# Altium project CRD25DA12N-FMC V1-1 (07-2023).PrjPcb (part 4 of 8)
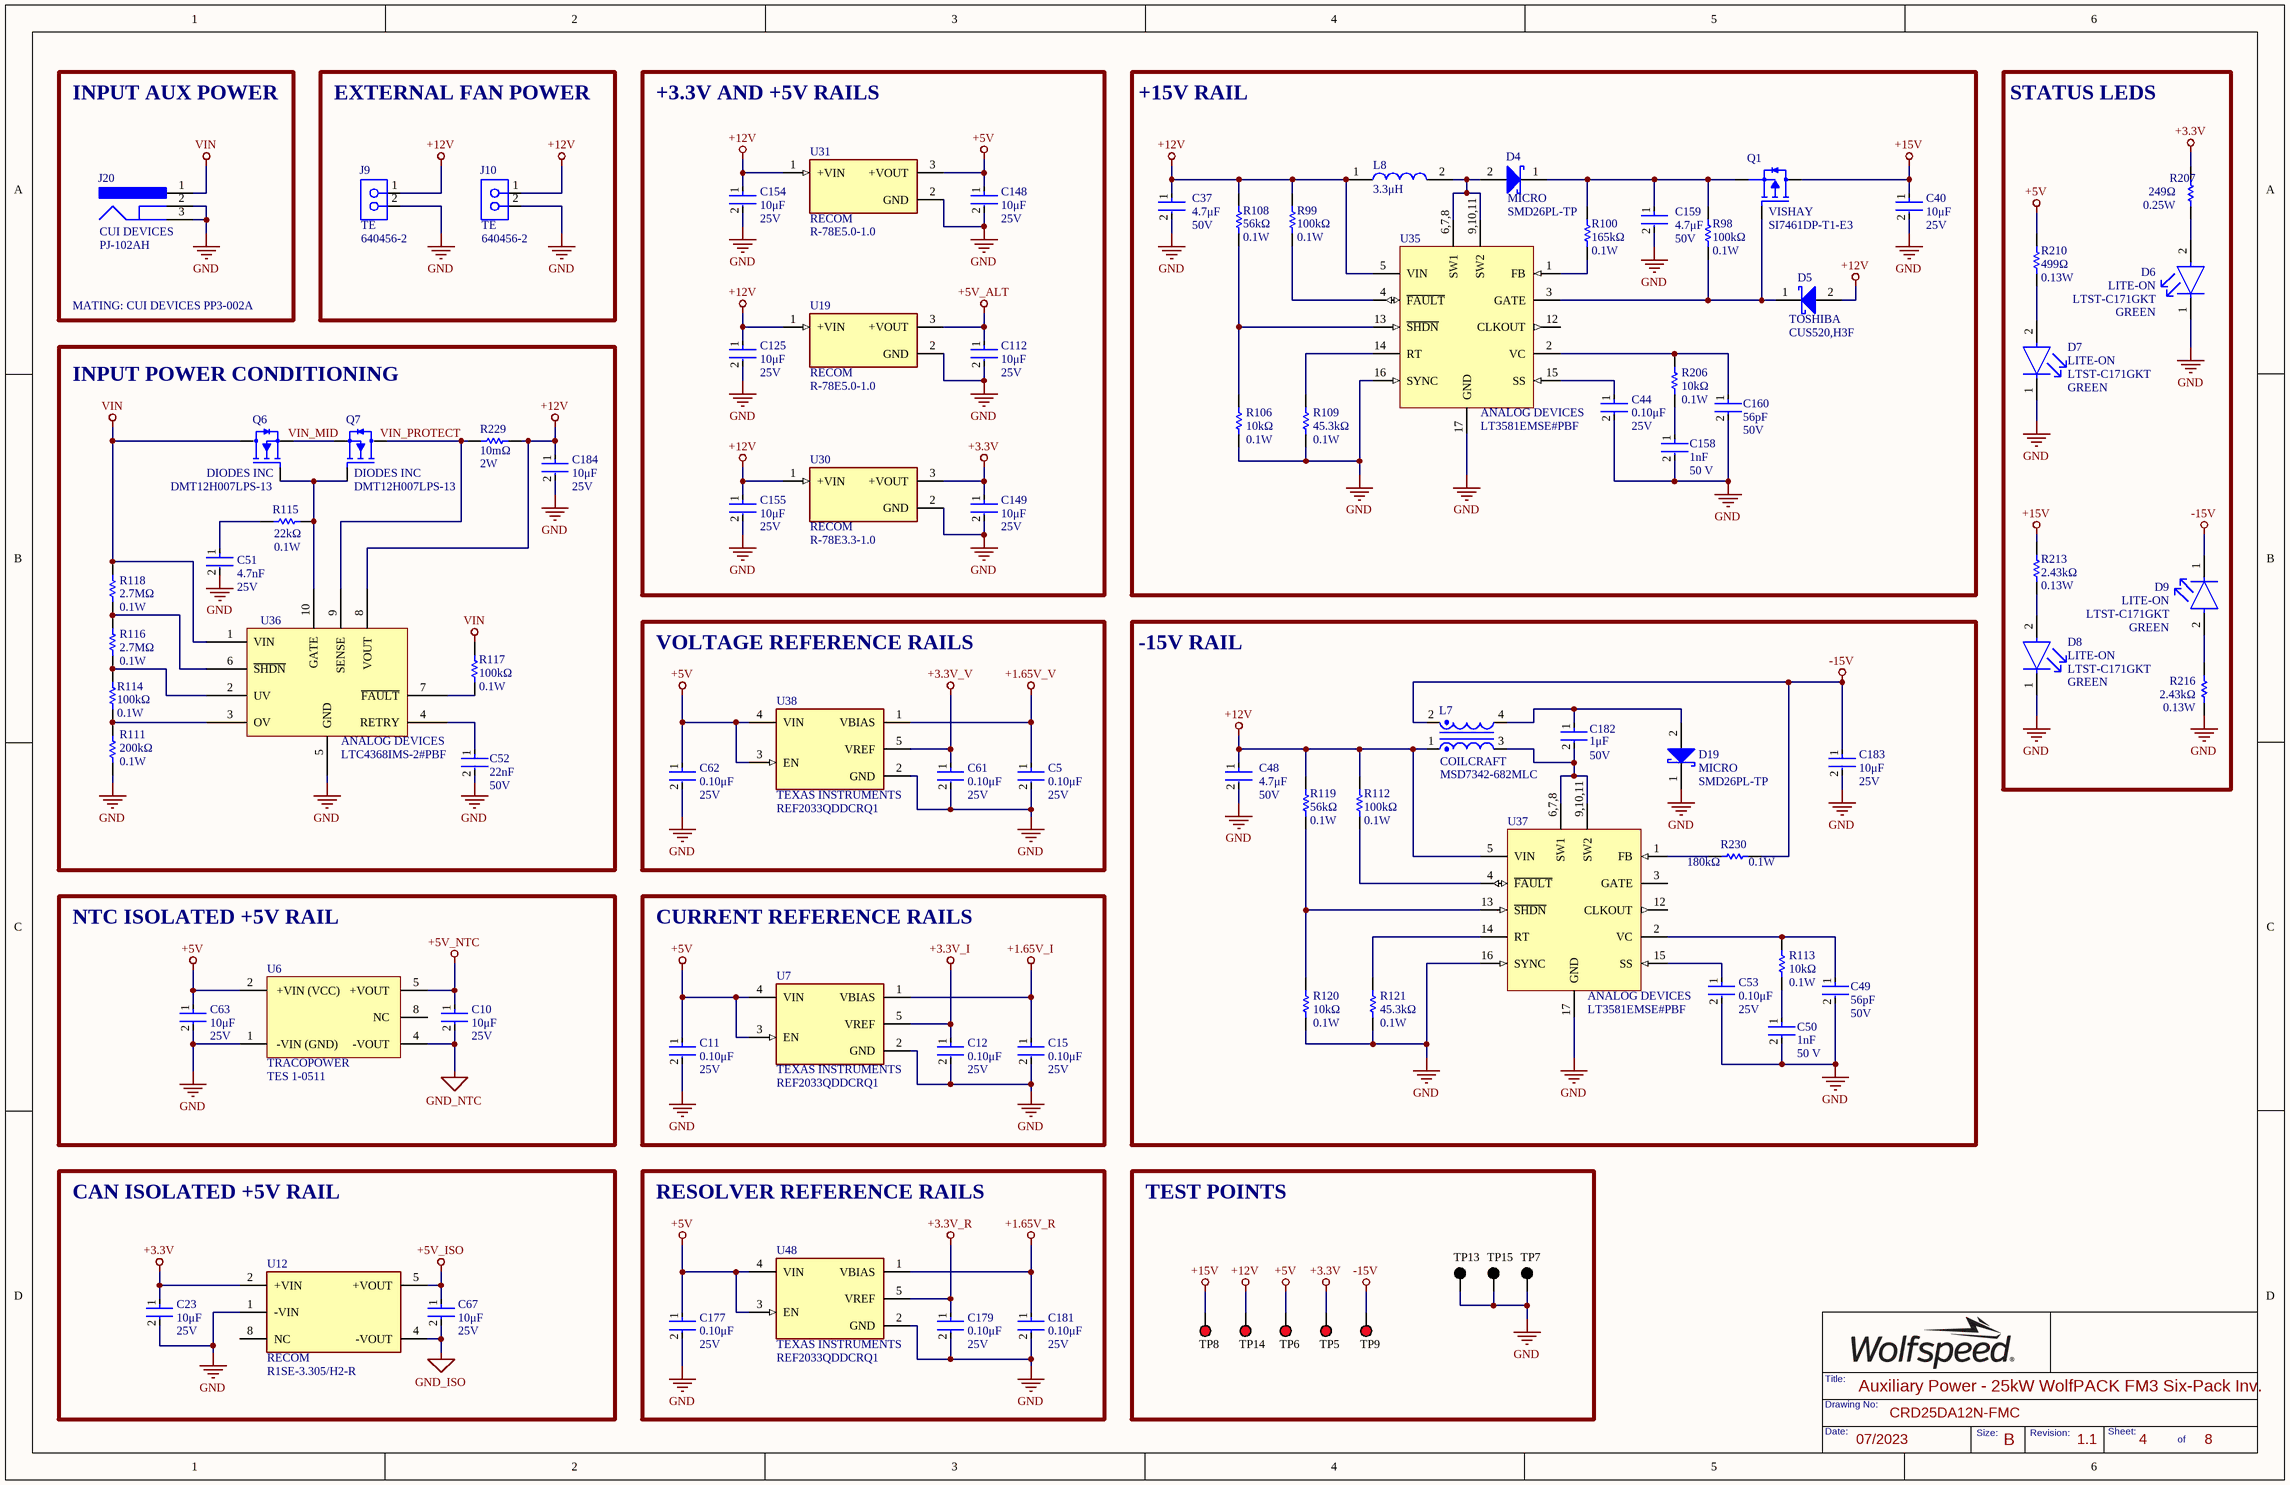
[diagram p9: 04 - Auxiliary Power.SchDoc]

## Sheet 04 - Auxiliary Power.SchDoc: Auxiliary Power - 25kW WolfPACK FM3 Six-Pack Inv. (continued)

### Library data of the parts (continued)
U19 U31 = R-78E5.0-1.0: DC DC CONVERTER 5V 5W; Number of Outputs: 1; Min Input Voltage: 8V; Max Input Voltage: 28V; Max Output Current: 1A; Efficiency: 91%; Supplier 1: Rs; Manufacturer: RECOM; Manufacturer Part Number: R-78E5.0-1.0; RoHS: Yes; Category: Voltage Regulators - Switching; Stock 1: 661; Mount: Through Hole; Case/Package: SIP; Weight: 2g; Min Operating Temperature: -40°C; Max Operating Temperature: 85°C; Packaging: Rail/Tube; Voltage - Output 1: 5V; Max Power Dissipation: 5W; Output Power: 5W; Current - Output 1: 1A; Package Quantity: 42; Max Output Voltage: 5V; Features: SCP; Length: 11.6mm; Width: 8.5mm; Height: 10.4mm; Lead Free: Lead Free; RoHS Compliant: Yes; ComponentLink1URL: http://www.farnell.com/datasheets/2787646.pdf?src-supplier=Farnell; ComponentLink1Description: http://www.farnell.com/datasheets/2787646.pdf?src-supplier=Farnell; ComponentLink2URL: http://www.mouser.com/ds/2/468/R-78Exx-1.0-958279.pdf?src-supplier=Mouser; ComponentLink2Description: http://www.mouser.com/ds/2/468/R-78Exx-1.0-958279.pdf?src-supplier=Mouser; ComponentLink3URL: https://www.recom-power.com/pdf/Innoline/R-78Exx-1.0.pdf?src-supplier=Digi-Key; ComponentLink3Description: https://www.recom-power.com/pdf/Innoline/R-78Exx-1.0.pdf?src-supplier=Digi-Key; ComponentLink4URL: http://www.farnell.com/datasheets/1848475.pdf?src-supplier=Newark; ComponentLink4Description: http://www.farnell.com/datasheets/1848475.pdf?src-supplier=Newark; ComponentLink5URL: http://www.farnell.com/datasheets/2787646.pdf?src-supplier=Element14; ComponentLink5Description: http://www.farnell.com/datasheets/2787646.pdf?src-supplier=Element14; ComponentLink6URL: http://datasheet.octopart.com/R-78E5.0-1.0-Recom-Power-datasheet-68298118.pdf?src-supplier=Rs; ComponentLink6Description: http://datasheet.octopart.com/R-78E5.0-1.0-Recom-Power-datasheet-68298118.pdf?src-supplier=Rs; Supplier Part Number 1: 1446013; Package: 3-SIP; Value: N/A
U30 = R-78E3.3-1.0: DC DC CONVERTER 3.3V 3W; Number of Outputs: 1; Min Input Voltage: 8V; Max Input Voltage: 28V; Max Output Current: 1A; Efficiency: 91%; Max Output Power: 3.3W; Min Input Voltage (DC): 7V; Supplier 1: Rs; Manufacturer: RECOM; Manufacturer Part Number: R-78E3.3-1.0; RoHS: Yes; Category: Board Mount Modules; Stock 1: 1; Pricing 1: 1=3.93700, 5=3.82200, 10=3.69700, 25=3.58300, 50=3.46900 (USD); Mount: Through Hole; Case/Package: SIP; Weight: 2g; Min Operating Temperature: -40°C; Max Operating Temperature: 85°C; Packaging: Rail/Tube; Voltage - Output 1: 3.3V; Nominal Output Voltage: 3.3V; Max Input Voltage (DC): 28V; Max Power Dissipation: 3W; Max Output Voltage: 3.3V; Features: SCP; Series: INNOLINE R-78E; Length: 11.6mm; Width: 8.5mm; Height: 10.4mm; Reach SVHC Compliant: Yes; Lead Free: Lead Free; RoHS Compliant: Yes; ComponentLink1URL: http://www.farnell.com/datasheets/2787646.pdf?src-supplier=Farnell; ComponentLink1Description: http://www.farnell.com/datasheets/2787646.pdf?src-supplier=Farnell; ComponentLink2URL: https://www.recom-power.com/pdf/Innoline/R-78Exx-1.0.pdf?src-supplier=Digi-Key; ComponentLink2Description: https://www.recom-power.com/pdf/Innoline/R-78Exx-1.0.pdf?src-supplier=Digi-Key; ComponentLink3URL: http://www.farnell.com/datasheets/1965125.pdf?src-supplier=Element14; ComponentLink3Description: http://www.farnell.com/datasheets/1965125.pdf?src-supplier=Element14; ComponentLink4URL: http://www.farnell.com/datasheets/2787646.pdf?src-supplier=Newark; ComponentLink4Description: http://www.farnell.com/datasheets/2787646.pdf?src-supplier=Newark; Supplier Part Number 1: 9176626; Package: 3-SIP; Value: N/A
U35 U37 = LT3581EMSE#PBF: IC REG MULTI CONFG ADJ 16MSOP; Number of Outputs: 1; Frequency Adjust Range: Up - 2.5MHz; RoHS: TRUE; PackageDescription: 16-Pin Plastic MSOP, Exposed Die Pad, Body 4.039 x 3 mm, Pitch 0.5 mm; Mounting Technology: Surface Mount; ComponentLink3URL: http://cds.linear.com/docs/en/packaging/05081667_F_MSE16.pdf; PackageReference: MSE-16; ComponentLink2Description: Datasheet; Manufacturer: ANALOG DEVICES; ComponentLink3Description: Package Specification; ComponentLink1Description: Manufacturer URL; ComponentLink1URL: http://www.linear.com/; ComponentLink2URL: http://cds.linear.com/docs/en/datasheet/3581f.pdf; PackageVersion: Rev. F, 05/2013; Supplier 1: Newark; Supplier Part Number 1: 51AK8743; Manufacturer Part Number: LT3581EMSE#PBF; Package: 16-TFSOP; Value: N/A
U36 = LTC4368IMS-2#PBF: IC SURGE SUPPRESSION ADJ 10MSOP; Supplier 1: Digi-Key; Manufacturer: ANALOG DEVICES; Manufacturer Part Number: LTC4368IMS-2#PBF; RoHS: Yes; Category: Power Management ICs; Pricing 1: 1=6.69000, 10=6.03900, 25=5.75840, 100=5.00000, 250=4.77528, 500=4.35396, 1000=3.97500 (USD); ComponentLink1URL: http://www.linear.com/docs/57622?src-supplier=Digi-Key; ComponentLink1Description: http://www.linear.com/docs/57622?src-supplier=Digi-Key; Supplier Part Number 1: 505-LTC4368IMS-2#PBF-ND; Package: 10-MSOP; Value: N/A

## Sheet 05 - Gate Drivers.SchDoc: Gate Drivers - 25kW WolfPACK FM3 Six-Pack Inv.
size 431 x 279 mm; Date: 07/2023; DocumentNumber: CRD25DA12N-FMC; Revision: 1.1; SheetNumber: 5; SheetTotal: 8; SheetSize: B
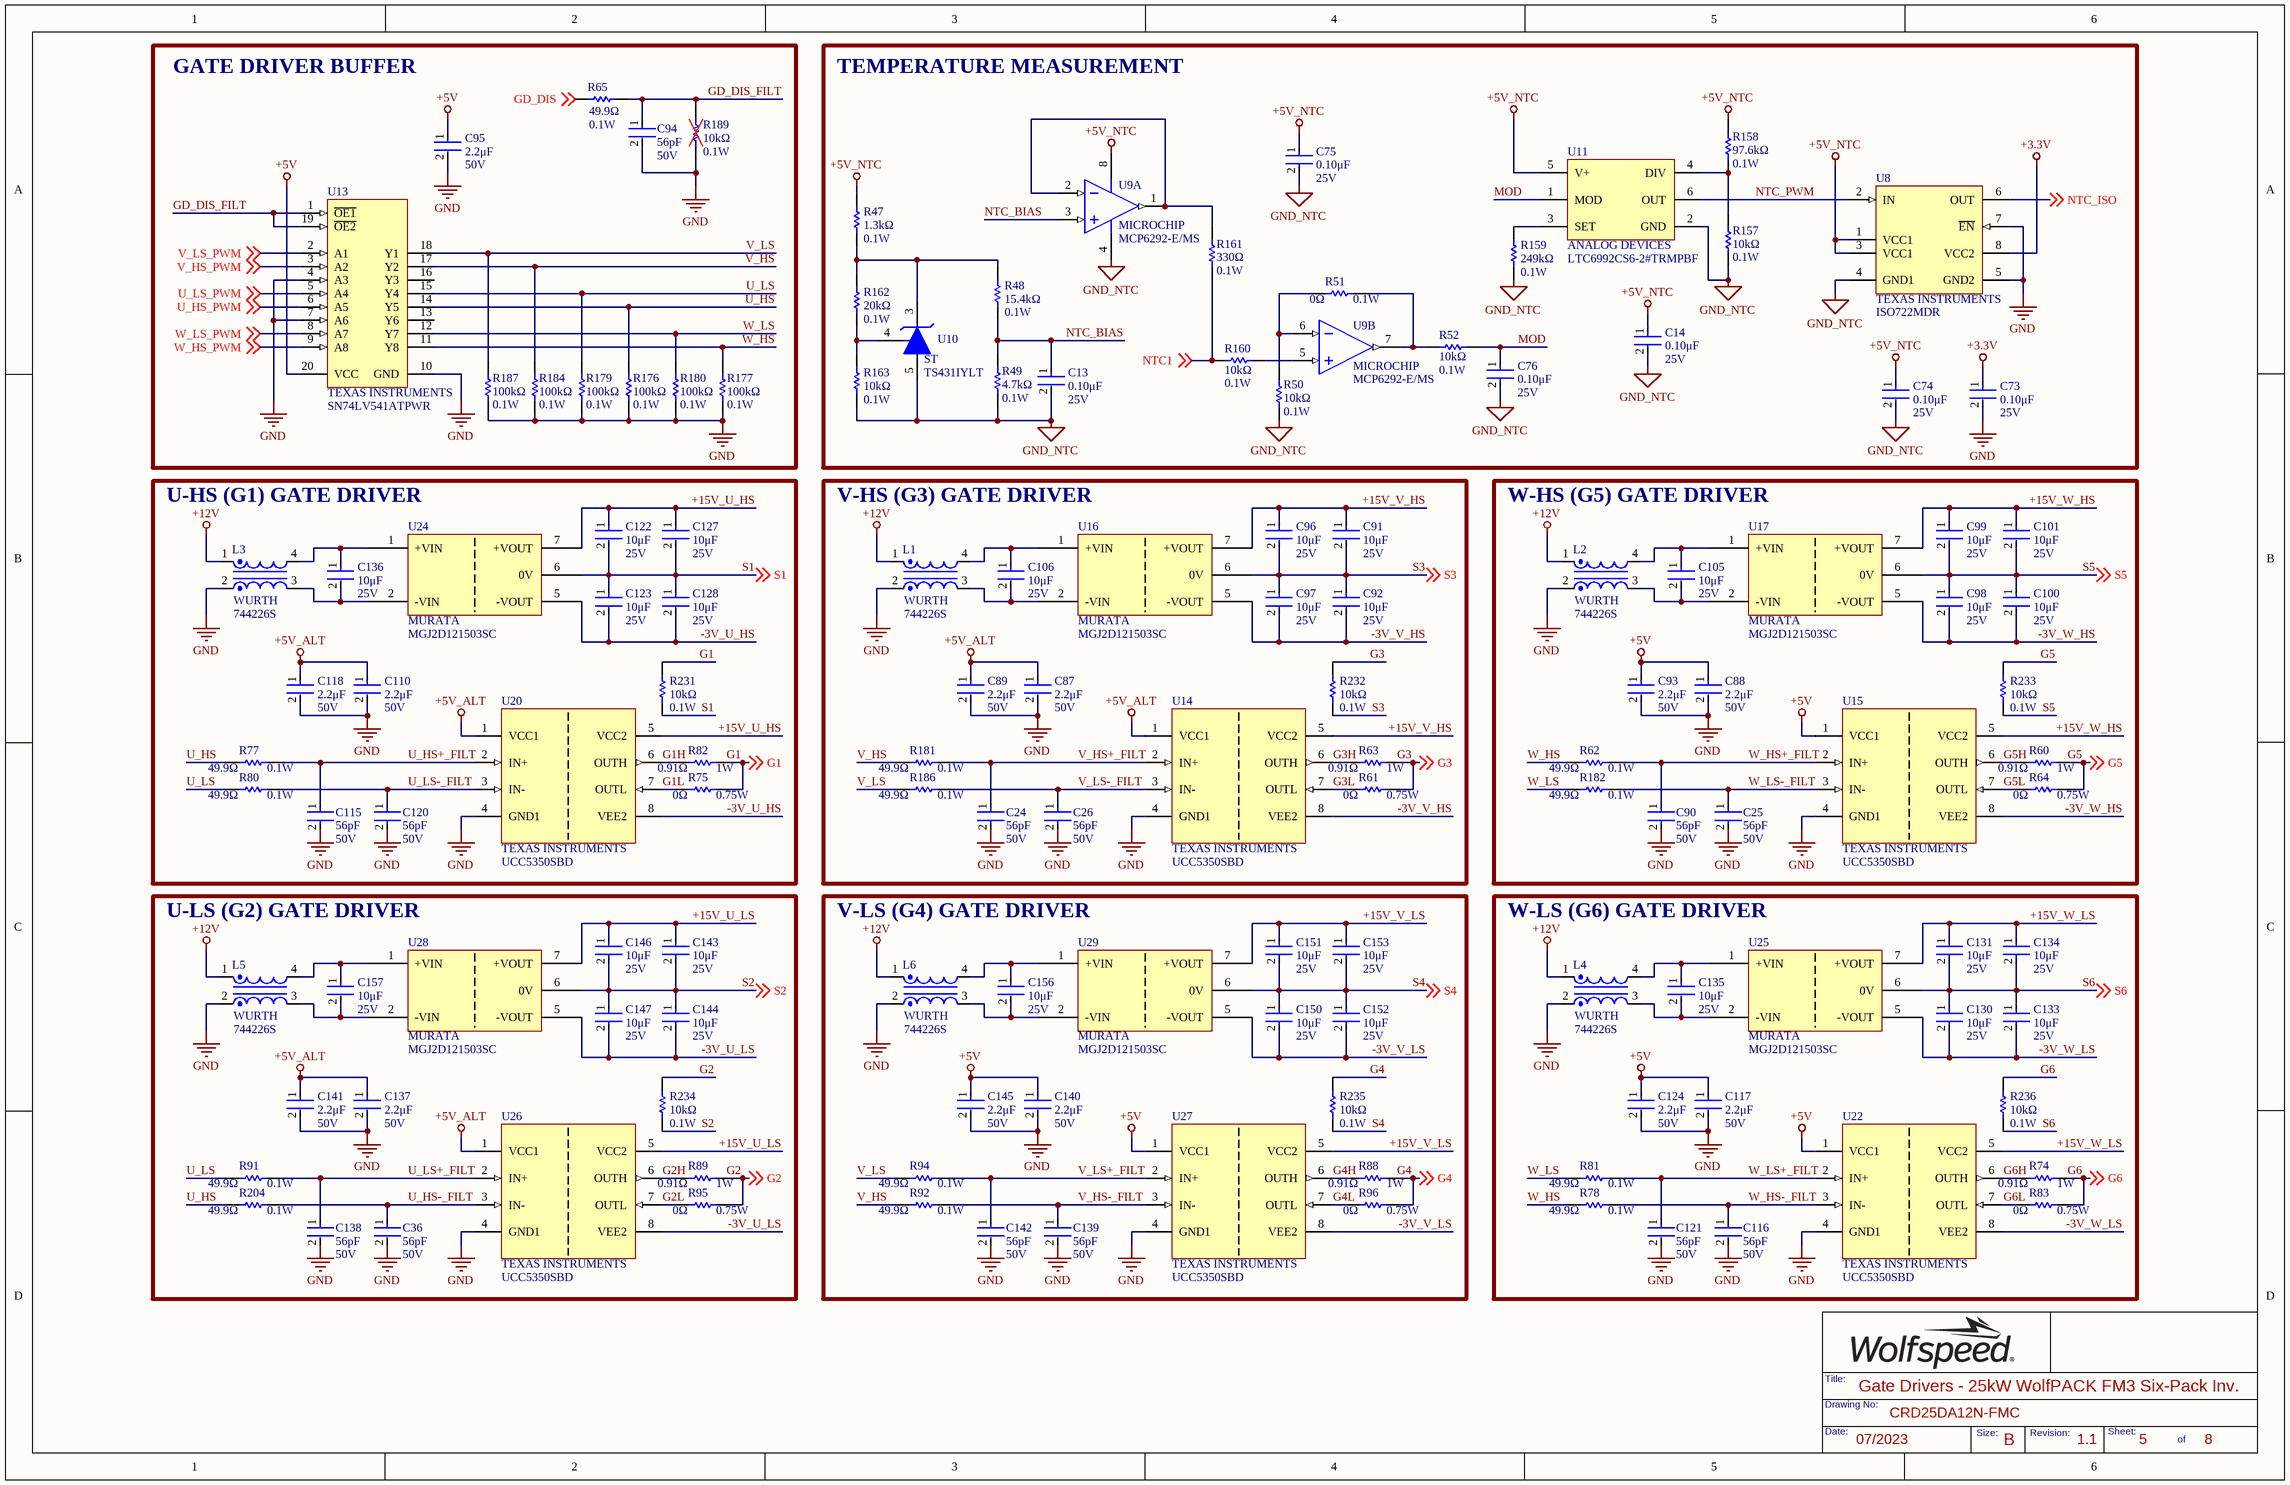
[diagram p4: 05 - Gate Drivers.SchDoc]

### Parts
C13  Voltage Rating: 25V  Capacitance: 0.10μF  [FP-C0603C-CF-IPC_B]  (hidden comment: C0603C104K3RACTU)
C14  Voltage Rating: 25V  Capacitance: 0.10μF  [FP-C0603C-CF-IPC_B]  (hidden comment: C0603C104K3RACTU)
C24  Capacitance: 56pF  Voltage Rating: 50V  [FP-C0603C-CF-IPC_B]  (hidden comment: CL10C560JB8NNNC)
C25  Capacitance: 56pF  Voltage Rating: 50V  [FP-C0603C-CF-IPC_B]  (hidden comment: CL10C560JB8NNNC)
C26  Capacitance: 56pF  Voltage Rating: 50V  [FP-C0603C-CF-IPC_B]  (hidden comment: CL10C560JB8NNNC)
C36  Capacitance: 56pF  Voltage Rating: 50V  [FP-C0603C-CF-IPC_B]  (hidden comment: CL10C560JB8NNNC)
C73  Voltage Rating: 25V  Capacitance: 0.10μF  [FP-C0603C-CF-IPC_B]  (hidden comment: C0603C104K3RACTU)
C74  Voltage Rating: 25V  Capacitance: 0.10μF  [FP-C0603C-CF-IPC_B]  (hidden comment: C0603C104K3RACTU)
C75  Voltage Rating: 25V  Capacitance: 0.10μF  [FP-C0603C-CF-IPC_B]  (hidden comment: C0603C104K3RACTU)
C76  Voltage Rating: 25V  Capacitance: 0.10μF  [FP-C0603C-CF-IPC_B]  (hidden comment: C0603C104K3RACTU)
C87  Voltage Rating: 50V  Capacitance: 2.2μF  [FP-C0603C-CF-IPC_B]  (hidden comment: GRT188R61H225ME13D)
C88  Voltage Rating: 50V  Capacitance: 2.2μF  [FP-C0603C-CF-IPC_B]  (hidden comment: GRT188R61H225ME13D)
C89  Voltage Rating: 50V  Capacitance: 2.2μF  [FP-C0603C-CF-IPC_B]  (hidden comment: GRT188R61H225ME13D)
C90  Capacitance: 56pF  Voltage Rating: 50V  [FP-C0603C-CF-IPC_B]  (hidden comment: CL10C560JB8NNNC)
C91  Voltage Rating: 25V  Capacitance: 10μF  [FP-CL31-IPC_B]  (hidden comment: CL31B106KAHSFNE)
C92  Voltage Rating: 25V  Capacitance: 10μF  [FP-CL31-IPC_B]  (hidden comment: CL31B106KAHSFNE)
C93  Voltage Rating: 50V  Capacitance: 2.2μF  [FP-C0603C-CF-IPC_B]  (hidden comment: GRT188R61H225ME13D)
C94  Capacitance: 56pF  Voltage Rating: 50V  [FP-C0603C-CF-IPC_B]  (hidden comment: CL10C560JB8NNNC)
C95  Voltage Rating: 50V  Capacitance: 2.2μF  [FP-C0603C-CF-IPC_B]  (hidden comment: GRT188R61H225ME13D)
C96  Voltage Rating: 25V  Capacitance: 10μF  [FP-CL31-IPC_B]  (hidden comment: CL31B106KAHSFNE)
C97  Voltage Rating: 25V  Capacitance: 10μF  [FP-CL31-IPC_B]  (hidden comment: CL31B106KAHSFNE)
C98  Voltage Rating: 25V  Capacitance: 10μF  [FP-CL31-IPC_B]  (hidden comment: CL31B106KAHSFNE)
C99  Voltage Rating: 25V  Capacitance: 10μF  [FP-CL31-IPC_B]  (hidden comment: CL31B106KAHSFNE)
C100  Voltage Rating: 25V  Capacitance: 10μF  [FP-CL31-IPC_B]  (hidden comment: CL31B106KAHSFNE)
C101  Voltage Rating: 25V  Capacitance: 10μF  [FP-CL31-IPC_B]  (hidden comment: CL31B106KAHSFNE)
C105  Voltage Rating: 25V  Capacitance: 10μF  [FP-CL31-IPC_B]  (hidden comment: CL31B106KAHSFNE)
C106  Voltage Rating: 25V  Capacitance: 10μF  [FP-CL31-IPC_B]  (hidden comment: CL31B106KAHSFNE)
C110  Voltage Rating: 50V  Capacitance: 2.2μF  [FP-C0603C-CF-IPC_B]  (hidden comment: GRT188R61H225ME13D)
C115  Capacitance: 56pF  Voltage Rating: 50V  [FP-C0603C-CF-IPC_B]  (hidden comment: CL10C560JB8NNNC)
C116  Capacitance: 56pF  Voltage Rating: 50V  [FP-C0603C-CF-IPC_B]  (hidden comment: CL10C560JB8NNNC)
C117  Voltage Rating: 50V  Capacitance: 2.2μF  [FP-C0603C-CF-IPC_B]  (hidden comment: GRT188R61H225ME13D)
C118  Voltage Rating: 50V  Capacitance: 2.2μF  [FP-C0603C-CF-IPC_B]  (hidden comment: GRT188R61H225ME13D)
C120  Capacitance: 56pF  Voltage Rating: 50V  [FP-C0603C-CF-IPC_B]  (hidden comment: CL10C560JB8NNNC)
C121  Capacitance: 56pF  Voltage Rating: 50V  [FP-C0603C-CF-IPC_B]  (hidden comment: CL10C560JB8NNNC)
C122  Voltage Rating: 25V  Capacitance: 10μF  [FP-CL31-IPC_B]  (hidden comment: CL31B106KAHSFNE)
C123  Voltage Rating: 25V  Capacitance: 10μF  [FP-CL31-IPC_B]  (hidden comment: CL31B106KAHSFNE)
C124  Voltage Rating: 50V  Capacitance: 2.2μF  [FP-C0603C-CF-IPC_B]  (hidden comment: GRT188R61H225ME13D)
C127  Voltage Rating: 25V  Capacitance: 10μF  [FP-CL31-IPC_B]  (hidden comment: CL31B106KAHSFNE)
C128  Voltage Rating: 25V  Capacitance: 10μF  [FP-CL31-IPC_B]  (hidden comment: CL31B106KAHSFNE)
C130  Voltage Rating: 25V  Capacitance: 10μF  [FP-CL31-IPC_B]  (hidden comment: CL31B106KAHSFNE)
C131  Voltage Rating: 25V  Capacitance: 10μF  [FP-CL31-IPC_B]  (hidden comment: CL31B106KAHSFNE)
C133  Voltage Rating: 25V  Capacitance: 10μF  [FP-CL31-IPC_B]  (hidden comment: CL31B106KAHSFNE)
C134  Voltage Rating: 25V  Capacitance: 10μF  [FP-CL31-IPC_B]  (hidden comment: CL31B106KAHSFNE)
C135  Voltage Rating: 25V  Capacitance: 10μF  [FP-CL31-IPC_B]  (hidden comment: CL31B106KAHSFNE)
C136  Voltage Rating: 25V  Capacitance: 10μF  [FP-CL31-IPC_B]  (hidden comment: CL31B106KAHSFNE)
C137  Voltage Rating: 50V  Capacitance: 2.2μF  [FP-C0603C-CF-IPC_B]  (hidden comment: GRT188R61H225ME13D)
C138  Capacitance: 56pF  Voltage Rating: 50V  [FP-C0603C-CF-IPC_B]  (hidden comment: CL10C560JB8NNNC)
C139  Capacitance: 56pF  Voltage Rating: 50V  [FP-C0603C-CF-IPC_B]  (hidden comment: CL10C560JB8NNNC)
C140  Voltage Rating: 50V  Capacitance: 2.2μF  [FP-C0603C-CF-IPC_B]  (hidden comment: GRT188R61H225ME13D)
C141  Voltage Rating: 50V  Capacitance: 2.2μF  [FP-C0603C-CF-IPC_B]  (hidden comment: GRT188R61H225ME13D)
C142  Capacitance: 56pF  Voltage Rating: 50V  [FP-C0603C-CF-IPC_B]  (hidden comment: CL10C560JB8NNNC)
C143  Voltage Rating: 25V  Capacitance: 10μF  [FP-CL31-IPC_B]  (hidden comment: CL31B106KAHSFNE)
C144  Voltage Rating: 25V  Capacitance: 10μF  [FP-CL31-IPC_B]  (hidden comment: CL31B106KAHSFNE)
C145  Voltage Rating: 50V  Capacitance: 2.2μF  [FP-C0603C-CF-IPC_B]  (hidden comment: GRT188R61H225ME13D)
C146  Voltage Rating: 25V  Capacitance: 10μF  [FP-CL31-IPC_B]  (hidden comment: CL31B106KAHSFNE)
C147  Voltage Rating: 25V  Capacitance: 10μF  [FP-CL31-IPC_B]  (hidden comment: CL31B106KAHSFNE)
C150  Voltage Rating: 25V  Capacitance: 10μF  [FP-CL31-IPC_B]  (hidden comment: CL31B106KAHSFNE)
C151  Voltage Rating: 25V  Capacitance: 10μF  [FP-CL31-IPC_B]  (hidden comment: CL31B106KAHSFNE)
C152  Voltage Rating: 25V  Capacitance: 10μF  [FP-CL31-IPC_B]  (hidden comment: CL31B106KAHSFNE)
C153  Voltage Rating: 25V  Capacitance: 10μF  [FP-CL31-IPC_B]  (hidden comment: CL31B106KAHSFNE)
C156  Voltage Rating: 25V  Capacitance: 10μF  [FP-CL31-IPC_B]  (hidden comment: CL31B106KAHSFNE)
C157  Voltage Rating: 25V  Capacitance: 10μF  [FP-CL31-IPC_B]  (hidden comment: CL31B106KAHSFNE)
L1  744226S  Manufacturer Print: WURTH  [WE-SL2]
L2  744226S  Manufacturer Print: WURTH  [WE-SL2]
L3  744226S  Manufacturer Print: WURTH  [WE-SL2]
L4  744226S  Manufacturer Print: WURTH  [WE-SL2]
L5  744226S  Manufacturer Print: WURTH  [WE-SL2]
L6  744226S  Manufacturer Print: WURTH  [WE-SL2]
R47  Power Rating: 0.1W  Resistance: 1.3kΩ  [FP-MCR03-IPC_B]  (hidden comment: ERA3AEB132V)
R48  Power Rating: 0.1W  Resistance: 15.4kΩ  [FP-MCR03-IPC_B]  (hidden comment: RC1608F1542CS)
R49  Resistance: 4.7kΩ  Power Rating: 0.1W  [FP-MCR03-IPC_B]  (hidden comment: CRCW06034K70FKTA)
R50  Resistance: 10kΩ  Max Power Dissipation: 0.1W  [FP-MCR03-IPC_B]  (hidden comment: ERJ3EKF1002V)
R51  Resistance: 0Ω  Power Rating: 0.1W  [FP-MCR03-IPC_B]  (hidden comment: CRCW06030000Z0EB)
R52  Resistance: 10kΩ  Max Power Dissipation: 0.1W  [FP-MCR03-IPC_B]  (hidden comment: ERJ3EKF1002V)
R60  value 0.91Ω  Power: 1W  [RESC3125X70X40NL20T20]  (hidden comment: RCWE1210R910FKEA)
R61  value 0Ω  Power Rating: 0.75W  [RESC3125X70X40NL20T20]  (hidden comment: CRCW12100000Z0EAHP)
R62  Resistance: 49.9Ω  Power Rating: 0.1W  [FP-MCR03-IPC_B]  (hidden comment: ERJ-3EKF49R9V)
R63  value 0.91Ω  Power: 1W  [RESC3125X70X40NL20T20]  (hidden comment: RCWE1210R910FKEA)
R64  value 0Ω  Power Rating: 0.75W  [RESC3125X70X40NL20T20]  (hidden comment: CRCW12100000Z0EAHP)
R65  Resistance: 49.9Ω  Power Rating: 0.1W  [FP-MCR03-IPC_B]  (hidden comment: ERJ-3EKF49R9V)
R74  value 0.91Ω  Power: 1W  [RESC3125X70X40NL20T20]  (hidden comment: RCWE1210R910FKEA)
R75  value 0Ω  Power Rating: 0.75W  [RESC3125X70X40NL20T20]  (hidden comment: CRCW12100000Z0EAHP)
R77  Resistance: 49.9Ω  Power Rating: 0.1W  [FP-MCR03-IPC_B]  (hidden comment: ERJ-3EKF49R9V)
R78  Resistance: 49.9Ω  Power Rating: 0.1W  [FP-MCR03-IPC_B]  (hidden comment: ERJ-3EKF49R9V)
R80  Resistance: 49.9Ω  Power Rating: 0.1W  [FP-MCR03-IPC_B]  (hidden comment: ERJ-3EKF49R9V)
R81  Resistance: 49.9Ω  Power Rating: 0.1W  [FP-MCR03-IPC_B]  (hidden comment: ERJ-3EKF49R9V)
R82  value 0.91Ω  Power: 1W  [RESC3125X70X40NL20T20]  (hidden comment: RCWE1210R910FKEA)
R83  value 0Ω  Power Rating: 0.75W  [RESC3125X70X40NL20T20]  (hidden comment: CRCW12100000Z0EAHP)
R88  value 0.91Ω  Power: 1W  [RESC3125X70X40NL20T20]  (hidden comment: RCWE1210R910FKEA)
R89  value 0.91Ω  Power: 1W  [RESC3125X70X40NL20T20]  (hidden comment: RCWE1210R910FKEA)
R91  Resistance: 49.9Ω  Power Rating: 0.1W  [FP-MCR03-IPC_B]  (hidden comment: ERJ-3EKF49R9V)
R92  Resistance: 49.9Ω  Power Rating: 0.1W  [FP-MCR03-IPC_B]  (hidden comment: ERJ-3EKF49R9V)
R94  Resistance: 49.9Ω  Power Rating: 0.1W  [FP-MCR03-IPC_B]  (hidden comment: ERJ-3EKF49R9V)
R95  value 0Ω  Power Rating: 0.75W  [RESC3125X70X40NL20T20]  (hidden comment: CRCW12100000Z0EAHP)
R96  value 0Ω  Power Rating: 0.75W  [RESC3125X70X40NL20T20]  (hidden comment: CRCW12100000Z0EAHP)
R157  Resistance: 10kΩ  Max Power Dissipation: 0.1W  [FP-MCR03-IPC_B]  (hidden comment: ERJ3EKF1002V)
R158  Resistance: 97.6kΩ  Max Power Dissipation: 0.1W  [FP-MCR03-IPC_B]  (hidden comment: ERJ-3EKF9762V)
R159  Max Power Dissipation: 0.1W  Resistance: 249kΩ  [FP-MCR03-IPC_B]  (hidden comment: RMCF0603FT249K)
R160  Resistance: 10kΩ  Max Power Dissipation: 0.1W  [FP-MCR03-IPC_B]  (hidden comment: ERJ3EKF1002V)
R161  Resistance: 330Ω  Power Rating: 0.1W  [FP-MCR03-IPC_B]  (hidden comment: RC0603FR-13330RL)
R162  Resistance: 20kΩ  Power Rating: 0.1W  [FP-MCR03-IPC_B]  (hidden comment: CRCW060320K0FKTA)
R163  Resistance: 10kΩ  Max Power Dissipation: 0.1W  [FP-MCR03-IPC_B]  (hidden comment: ERJ3EKF1002V)
R176  Resistance: 100kΩ  Power Rating: 0.1W  [FP-MCR03-IPC_B]  (hidden comment: RC0603FR-07100KL)
R177  Resistance: 100kΩ  Power Rating: 0.1W  [FP-MCR03-IPC_B]  (hidden comment: RC0603FR-07100KL)
R179  Resistance: 100kΩ  Power Rating: 0.1W  [FP-MCR03-IPC_B]  (hidden comment: RC0603FR-07100KL)
R180  Resistance: 100kΩ  Power Rating: 0.1W  [FP-MCR03-IPC_B]  (hidden comment: RC0603FR-07100KL)
R181  Resistance: 49.9Ω  Power Rating: 0.1W  [FP-MCR03-IPC_B]  (hidden comment: ERJ-3EKF49R9V)
R182  Resistance: 49.9Ω  Power Rating: 0.1W  [FP-MCR03-IPC_B]  (hidden comment: ERJ-3EKF49R9V)
R184  Resistance: 100kΩ  Power Rating: 0.1W  [FP-MCR03-IPC_B]  (hidden comment: RC0603FR-07100KL)
R186  Resistance: 49.9Ω  Power Rating: 0.1W  [FP-MCR03-IPC_B]  (hidden comment: ERJ-3EKF49R9V)
R187  Resistance: 100kΩ  Power Rating: 0.1W  [FP-MCR03-IPC_B]  (hidden comment: RC0603FR-07100KL)
R189  Resistance: 10kΩ  Max Power Dissipation: 0.1W  [FP-MCR03-IPC_B]  (hidden comment: ERJ3EKF1002V)
R204  Resistance: 49.9Ω  Power Rating: 0.1W  [FP-MCR03-IPC_B]  (hidden comment: ERJ-3EKF49R9V)
R231  Resistance: 10kΩ  Max Power Dissipation: 0.1W  [FP-MCR03-IPC_B]  (hidden comment: ERJ3EKF1002V)
R232  Resistance: 10kΩ  Max Power Dissipation: 0.1W  [FP-MCR03-IPC_B]  (hidden comment: ERJ3EKF1002V)
R233  Resistance: 10kΩ  Max Power Dissipation: 0.1W  [FP-MCR03-IPC_B]  (hidden comment: ERJ3EKF1002V)
R234  Resistance: 10kΩ  Max Power Dissipation: 0.1W  [FP-MCR03-IPC_B]  (hidden comment: ERJ3EKF1002V)
R235  Resistance: 10kΩ  Max Power Dissipation: 0.1W  [FP-MCR03-IPC_B]  (hidden comment: ERJ3EKF1002V)
R236  Resistance: 10kΩ  Max Power Dissipation: 0.1W  [FP-MCR03-IPC_B]  (hidden comment: ERJ3EKF1002V)
U8  Manufacturer: TEXAS INSTRUMENTS  [D0008B_L]  (hidden comment: ISO722MDR)
U9  MCP6292-E/MS  Manufacturer Print: MICROCHIP  [MSOP-MS8_L]  (parts A,B of 2)
U10  TS431IYLT  Manufacturer Print: ST  [SOT95P280X145-5N]
U11  LTC6992CS6-2#TRMPBF  MANUFACTURER PRINT: ANALOG DEVICES  [SOT95P280X100-6N]
U13  Manufacturer: TEXAS INSTRUMENTS  [PW0020A_L]  (hidden comment: SN74LV541ATPWR)
U14  UCC5350SBD  Manufacturer Print: TEXAS INSTRUMENTS  [D0008B_HV]
U15  UCC5350SBD  Manufacturer Print: TEXAS INSTRUMENTS  [D0008B_HV]
U16  MGJ2D121503SC  Manufacturer Print: MURATA  [MGJ2D121509SC]
U17  MGJ2D121503SC  Manufacturer Print: MURATA  [MGJ2D121509SC]
U20  UCC5350SBD  Manufacturer Print: TEXAS INSTRUMENTS  [D0008B_HV]
U22  UCC5350SBD  Manufacturer Print: TEXAS INSTRUMENTS  [D0008B_HV]
U24  MGJ2D121503SC  Manufacturer Print: MURATA  [MGJ2D121509SC]
U25  MGJ2D121503SC  Manufacturer Print: MURATA  [MGJ2D121509SC]
U26  UCC5350SBD  Manufacturer Print: TEXAS INSTRUMENTS  [D0008B_HV]
U27  UCC5350SBD  Manufacturer Print: TEXAS INSTRUMENTS  [D0008B_HV]
U28  MGJ2D121503SC  Manufacturer Print: MURATA  [MGJ2D121509SC]
U29  MGJ2D121503SC  Manufacturer Print: MURATA  [MGJ2D121509SC]

### Blocks framed on the sheet
GATE DRIVER BUFFER: C94 C95 R65 R176 R177 R179 R180 R184 R187 R189 U13
TEMPERATURE MEASUREMENT: C13 C14 C73-C76 R47-R52 R157-R163 U8-U11
U-HS (G1) GATE DRIVER: C110 C115 C118 C120 C122 C123 C127 C128 C136 L3 R75 R77 R80 R82 R231 U20 U24
V-HS (G3) GATE DRIVER: C24 C26 C87 C89 C91 C92 C96 C97 C106 L1 R61 R63 R181 R186 R232 U14 U16
W-HS (G5) GATE DRIVER: C25 C88 C90 C93 C98-C101 C105 L2 R60 R62 R64 R182 R233 U15 U17
U-LS (G2) GATE DRIVER: C36 C137 C138 C141 C143 C144 C146 C147 C157 L5 R89 R91 R95 R204 R234 U26 U28
V-LS (G4) GATE DRIVER: C139 C140 C142 C145 C150-C153 C156 L6 R88 R92 R94 R96 R235 U27 U29
W-LS (G6) GATE DRIVER: C116 C117 C121 C124 C130 C131 C133-C135 L4 R74 R78 R81 R83 R236 U22 U25

### Nets
+3.3V: C73.1 U8.8(VCC2)
+5V: C88.1 C93.1 C95.1 C117.1 C124.1 C140.1 C145.1 U13.20(VCC) U15.1(VCC1) U22.1(VCC1) U27.1(VCC1)
+5V_ALT: C87.1 C89.1 C110.1 C118.1 C137.1 C141.1 U14.1(VCC1) U20.1(VCC1) U26.1(VCC1)
+5V_NTC: C14.1 C74.1 C75.1 R47.2 R158.2 U8.1(VCC1) U8.3(VCC1) U9.8(VDD) U11.5(V+)
+12V: L1.1 L2.1 L3.1 L4.1 L5.1 L6.1
GND: C24.2 C25.2 C26.2 C36.2 C73.2 C87.2 C88.2 C89.2 C90.2 C93.2 C94.2 C95.2 C110.2 C115.2 C116.2 C117.2 C118.2 C120.2 C121.2 C124.2 C137.2 C138.2 C139.2 C140.2 C141.2 C142.2 C145.2 L1.2 L2.2 L3.2 L4.2 L5.2 L6.2 R176.1 R177.1 R179.1 R180.1 R184.1 R187.1 R189.1 U8.5(GND2) U8.7(~{EN}) U13.4(A3) U13.7(A6) U13.10(GND) U14.4(GND1) U15.4(GND1) U20.4(GND1) U22.4(GND1) U26.4(GND1) U27.4(GND1)
GND_NTC: C13.2 C14.2 C74.2 C75.2 C76.2 R49.1 R50.1 R157.1 R159.1 R163.1 U8.4(GND1) U9.4(VSS) U10.5 U11.2(GND)
+15V_U_HS: C122.1 C127.1 U20.5(VCC2) U24.7(+VOUT)
+15V_U_LS: C143.1 C146.1 U26.5(VCC2) U28.7(+VOUT)
+15V_V_HS: C91.1 C96.1 U14.5(VCC2) U16.7(+VOUT)
+15V_V_LS: C151.1 C153.1 U27.5(VCC2) U29.7(+VOUT)
+15V_W_HS: C99.1 C101.1 U15.5(VCC2) U17.7(+VOUT)
+15V_W_LS: C131.1 C134.1 U22.5(VCC2) U25.7(+VOUT)
-3V_U_HS: C123.2 C128.2 U20.8(VEE2) U24.5(-VOUT)
-3V_U_LS: C144.2 C147.2 U26.8(VEE2) U28.5(-VOUT)
-3V_V_HS: C92.2 C97.2 U14.8(VEE2) U16.5(-VOUT)
-3V_V_LS: C150.2 C152.2 U27.8(VEE2) U29.5(-VOUT)
-3V_W_HS: C98.2 C100.2 U15.8(VEE2) U17.5(-VOUT)
-3V_W_LS: C130.2 C133.2 U22.8(VEE2) U25.5(-VOUT)
G1: R75.2 R82.2 R231.2 ; off-sheet G1
G1H: R82.1 U20.6(OUTH)
G1L: R75.1 U20.7(OUTL)
G2: R89.2 R95.2 R234.2 ; off-sheet G2
G2H: R89.1 U26.6(OUTH)
G2L: R95.1 U26.7(OUTL)
G3: R61.2 R63.2 R232.2 ; off-sheet G3
G3H: R63.1 U14.6(OUTH)
G3L: R61.1 U14.7(OUTL)
G4: R88.2 R96.2 R235.2 ; off-sheet G4
G4H: R88.1 U27.6(OUTH)
G4L: R96.1 U27.7(OUTL)
G5: R60.2 R64.2 R233.2 ; off-sheet G5
G5H: R60.1 U15.6(OUTH)
G5L: R64.1 U15.7(OUTL)
G6: R74.2 R83.2 R236.2 ; off-sheet G6
G6H: R74.1 U22.6(OUTH)
G6L: R83.1 U22.7(OUTL)
GD_DIS: R65.1 ; off-sheet GD_DIS
GD_DIS_FILT: C94.1 R65.2 R189.2 U13.1(~{OE1}) U13.19(~{OE2})
MOD: C76.1 R52.1 U11.1(MOD)
NTC1: R160.2 R161.1 ; off-sheet NTC1
NTC_BIAS: C13.1 R48.1 R49.2 U9.3(VINA+)
NTC_ISO: U8.6(OUT) ; off-sheet NTC_ISO
NTC_PWM: U8.2(IN) U11.6(OUT)
S1: C122.2 C123.1 C127.2 C128.1 R231.1 U24.6(0V) ; off-sheet S1
S2: C143.2 C144.1 C146.2 C147.1 R234.1 U28.6(0V) ; off-sheet S2
S3: C91.2 C92.1 C96.2 C97.1 R232.1 U16.6(0V) ; off-sheet S3
S4: C150.1 C151.2 C152.1 C153.2 R235.1 U29.6(0V) ; off-sheet S4
S5: C98.1 C99.2 C100.1 C101.2 R233.1 U17.6(0V) ; off-sheet S5
S6: C130.1 C131.2 C133.1 C134.2 R236.1 U25.6(0V) ; off-sheet S6
U_HS: R77.1 R176.2 R204.1 U13.14(Y5)
U_HS+_FILT: C115.1 R77.2 U20.2(IN+)
U_HS-_FILT: C36.1 R204.2 U26.3(IN-)
U_HS_PWM: U13.6(A5) ; off-sheet U_HS_PWM
U_LS: R80.1 R91.1 R179.2 U13.15(Y4)
U_LS+_FILT: C138.1 R91.2 U26.2(IN+)
U_LS-_FILT: C120.1 R80.2 U20.3(IN-)
U_LS_PWM: U13.5(A4) ; off-sheet U_LS_PWM
V_HS: R92.1 R181.1 R184.2 U13.17(Y2)
V_HS+_FILT: C24.1 R181.2 U14.2(IN+)
V_HS-_FILT: C139.1 R92.2 U27.3(IN-)
V_HS_PWM: U13.3(A2) ; off-sheet V_HS_PWM
V_LS: R94.1 R186.1 R187.2 U13.18(Y1)
V_LS+_FILT: C142.1 R94.2 U27.2(IN+)
V_LS-_FILT: C26.1 R186.2 U14.3(IN-)
V_LS_PWM: U13.2(A1) ; off-sheet V_LS_PWM
W_HS: R62.1 R78.1 R177.2 U13.11(Y8)
W_HS+_FILT: C90.1 R62.2 U15.2(IN+)
W_HS-_FILT: C116.1 R78.2 U22.3(IN-)
W_HS_PWM: U13.9(A8) ; off-sheet W_HS_PWM
W_LS: R81.1 R180.2 R182.1 U13.12(Y7)
W_LS+_FILT: C121.1 R81.2 U22.2(IN+)
W_LS-_FILT: C25.1 R182.2 U15.3(IN-)
W_LS_PWM: U13.8(A7) ; off-sheet W_LS_PWM
NetC105_1: C105.1 L2.4 U17.1(+VIN)
NetC105_2: C105.2 L2.3 U17.2(-VIN)
NetC106_1: C106.1 L1.4 U16.1(+VIN)
NetC106_2: C106.2 L1.3 U16.2(-VIN)
NetC135_1: C135.1 L4.4 U25.1(+VIN)
NetC135_2: C135.2 L4.3 U25.2(-VIN)
NetC136_1: C136.1 L3.4 U24.1(+VIN)
NetC136_2: C136.2 L3.3 U24.2(-VIN)
NetC156_1: C156.1 L6.4 U29.1(+VIN)
NetC156_2: C156.2 L6.3 U29.2(-VIN)
NetC157_1: C157.1 L5.4 U28.1(+VIN)
NetC157_2: C157.2 L5.3 U28.2(-VIN)
NetR47_1: R47.1 R48.2 R162.2 U10.3
NetR50_2: R50.2 R51.1 U9.6(VINB-)
NetR51_2: R51.2 R52.2 U9.7(VOUTB)
NetR157_2: R157.2 R158.1 U11.4(DIV)
NetR159_2: R159.2 U11.3(SET)
NetR160_1: R160.1 U9.5(VINB+)
NetR161_2: R161.2 U9.1(VOUTA) U9.2(VINA-)
NetR162_1: R162.1 R163.2 U10.4

Not connected (* = marked no-connect by the designer): U13 13(Y6) 16(Y3)

### Notes on the sheet
- Title:
- Date:
- Drawing No:
- Size:
- Revision:
- Sheet:
- of